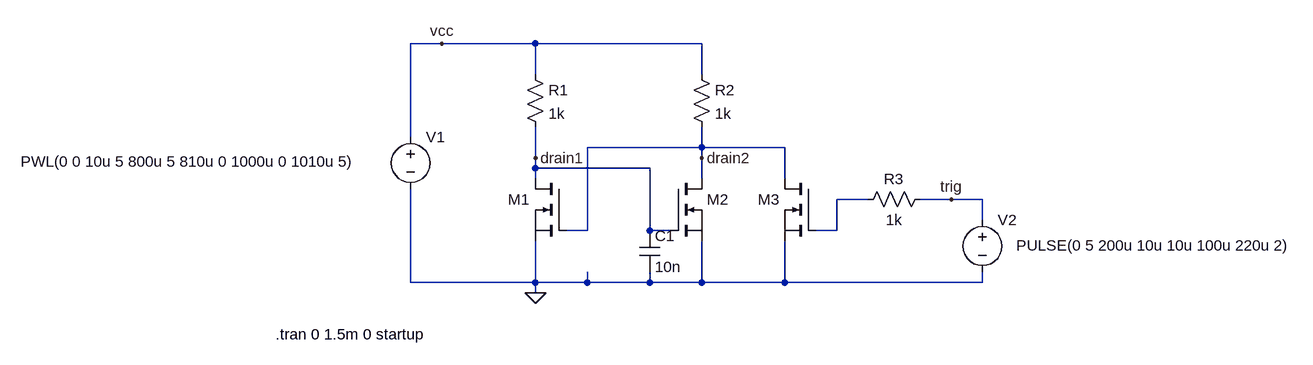
[diagram p0: schematic multivibratore.asc]
multivibratore.asc, the LTspice schematic file:
Version 4
SHEET 1 1132 680
WIRE -208 -608 -256 -608
WIRE -64 -608 -208 -608
WIRE 192 -608 -64 -608
WIRE -64 -560 -64 -608
WIRE 192 -560 192 -608
WIRE -256 -464 -256 -608
WIRE 192 -448 192 -480
WIRE 192 -448 16 -448
WIRE 320 -448 192 -448
WIRE -64 -432 -64 -480
WIRE 192 -432 192 -448
WIRE -64 -416 -64 -432
WIRE 112 -416 -64 -416
WIRE -64 -400 -64 -416
WIRE 192 -400 192 -432
WIRE 320 -400 320 -448
WIRE 448 -368 400 -368
WIRE 576 -368 528 -368
WIRE 624 -368 576 -368
WIRE 624 -336 624 -368
WIRE 16 -320 16 -448
WIRE 16 -320 -16 -320
WIRE 112 -320 112 -416
WIRE 144 -320 112 -320
WIRE 400 -320 400 -368
WIRE 400 -320 368 -320
WIRE -256 -240 -256 -384
WIRE -64 -240 -64 -304
WIRE -64 -240 -256 -240
WIRE 16 -240 16 -256
WIRE 16 -240 -64 -240
WIRE 112 -240 112 -256
WIRE 112 -240 16 -240
WIRE 192 -240 192 -304
WIRE 192 -240 112 -240
WIRE 320 -240 320 -304
WIRE 320 -240 192 -240
WIRE 624 -240 624 -256
WIRE 624 -240 320 -240
WIRE -64 -224 -64 -240
FLAG -64 -224 0
FLAG -208 -608 vcc
FLAG -64 -432 drain1
FLAG 192 -432 drain2
FLAG 576 -368 trig
SYMBOL res -80 -576 R0
SYMATTR InstName R1
SYMATTR Value 1k
SYMBOL voltage -256 -480 R0
WINDOW 3 -600 54 Left 2
WINDOW 123 0 0 Left 0
WINDOW 39 0 0 Left 0
SYMATTR Value PWL(0 0 10u 5 800u 5 810u 0 1000u 0 1010u 5)
SYMATTR InstName V1
SYMBOL res 176 -576 R0
SYMATTR InstName R2
SYMATTR Value 1k
SYMBOL cap 96 -320 R0
SYMATTR InstName C1
SYMATTR Value 10n
SYMBOL voltage 624 -352 R0
WINDOW 3 52 55 Left 2
WINDOW 123 0 0 Left 0
WINDOW 39 0 0 Left 0
SYMATTR Value PULSE(0 5 200u 10u 10u 100u 220u 2)
SYMATTR InstName V2
SYMBOL res 544 -384 R90
WINDOW 0 0 56 VBottom 2
WINDOW 3 32 56 VTop 2
SYMATTR InstName R3
SYMATTR Value 1k
SYMBOL nmos -16 -400 M0
WINDOW 3 56 72 Invisible 2
SYMATTR Value BSS123
SYMATTR InstName M1
SYMBOL nmos 144 -400 R0
WINDOW 3 55 98 Invisible 2
SYMATTR Value BSS123
SYMATTR InstName M2
SYMBOL nmos 368 -400 M0
WINDOW 3 56 72 Invisible 2
SYMATTR Value BSS123
SYMATTR InstName M3
TEXT -464 -160 Left 2 !.tran 0 1.5m 0 startup

The netlist it stands for:
* multivibratore.asc
R1 vcc drain1 1k
V1 vcc 0 PWL(0 0 10u 5 800u 5 810u 0 1000u 0 1010u 5)
R2 vcc drain2 1k
C1 drain1 0 10n
V2 trig 0 PULSE(0 5 200u 10u 10u 100u 220u 2)
R3 trig N001 1k
M1 drain1 drain2 0 0 BSS123
M2 drain2 drain1 0 0 BSS123
M3 drain2 N001 0 0 BSS123
.model NMOS NMOS
.model PMOS PMOS
.lib standard.mos
.tran 0 1.5m 0 startup
.backanno
.end